# EAGLE schematic SMD_optek_led-mosfet (EAGLE 6.2)
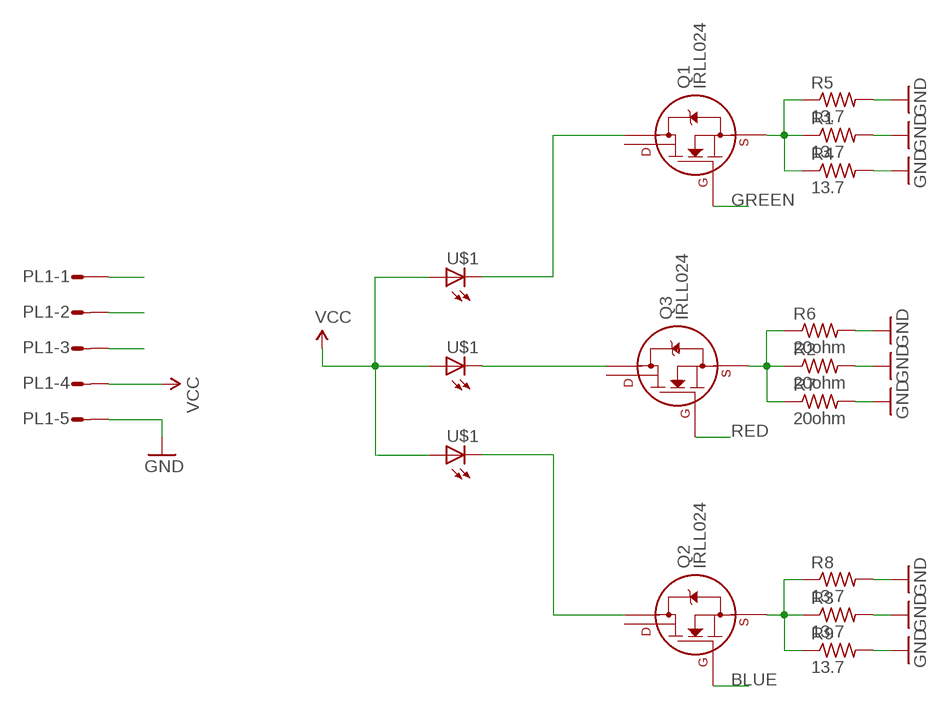
[diagram p0: schematic, sheet 1]

## Parts
PL1  DF3-05R  [DF3R-05]
Q1  IRLL024  [SOT-223]
Q2  IRLL024  [SOT-223]
Q3  IRLL024  [SOT-223]
R1  13.7  R-US_R1210  [R1210]
R2  20ohm  R-US_R1210  [R1210]
R3  13.7  R-US_R1210  [R1210]
R4  13.7  R-US_R1210  [R1210]
R5  13.7  R-US_R1210  [R1210]
R6  20ohm  R-US_R1210  [R1210]
R7  20ohm  R-US_R1210  [R1210]
R8  13.7  R-US_R1210  [R1210]
R9  13.7  R-US_R1210  [R1210]
U$1  OVSPRGBCR4  [OVSPRGBCR4]

## Nets
BLUE: PL1.3 Q2.1(G)
GND: PL1.5 R1.2 R2.2 R3.2 R4.2 R5.2 R6.2 R7.2 R8.2 R9.2
GREEN: PL1.1 Q1.1(G)
N$1: Q1.2(D1) U$1.6(GREEN_C)
N$2: Q3.2(D1) U$1.5(RED_C)
N$3: Q2.2(D1) U$1.4(BLUE_C)
N$4: Q1.3(S) R1.1 R4.1 R5.1
N$5: Q3.3(S) R2.1 R6.1 R7.1
N$6: Q2.3(S) R3.1 R8.1 R9.1
RED: PL1.2 Q3.1(G)
VCC: PL1.4 U$1.1(GREEN_A) U$1.2(RED_A) U$1.3(BLUE_A)
Unconnected: Q1.4(D2) Q2.4(D2) Q3.4(D2)

## Library data of the parts
PL1 = con-hirose-df3:DF3-05: Single row connector 2mm 5 way
Q1-Q3 = transistors:IRLL*: International Rectifier IRLL series N-channel enhancement mode MOSFET HEXFET Power MOSFET SOT-223 Includes body diode
R1-R9 = adafruit:R-US_: RESISTOR, American symbol
U$1 = led:OVSPRGBCR4